# EAGLE design de10_out_board (EAGLE 9.0.1)
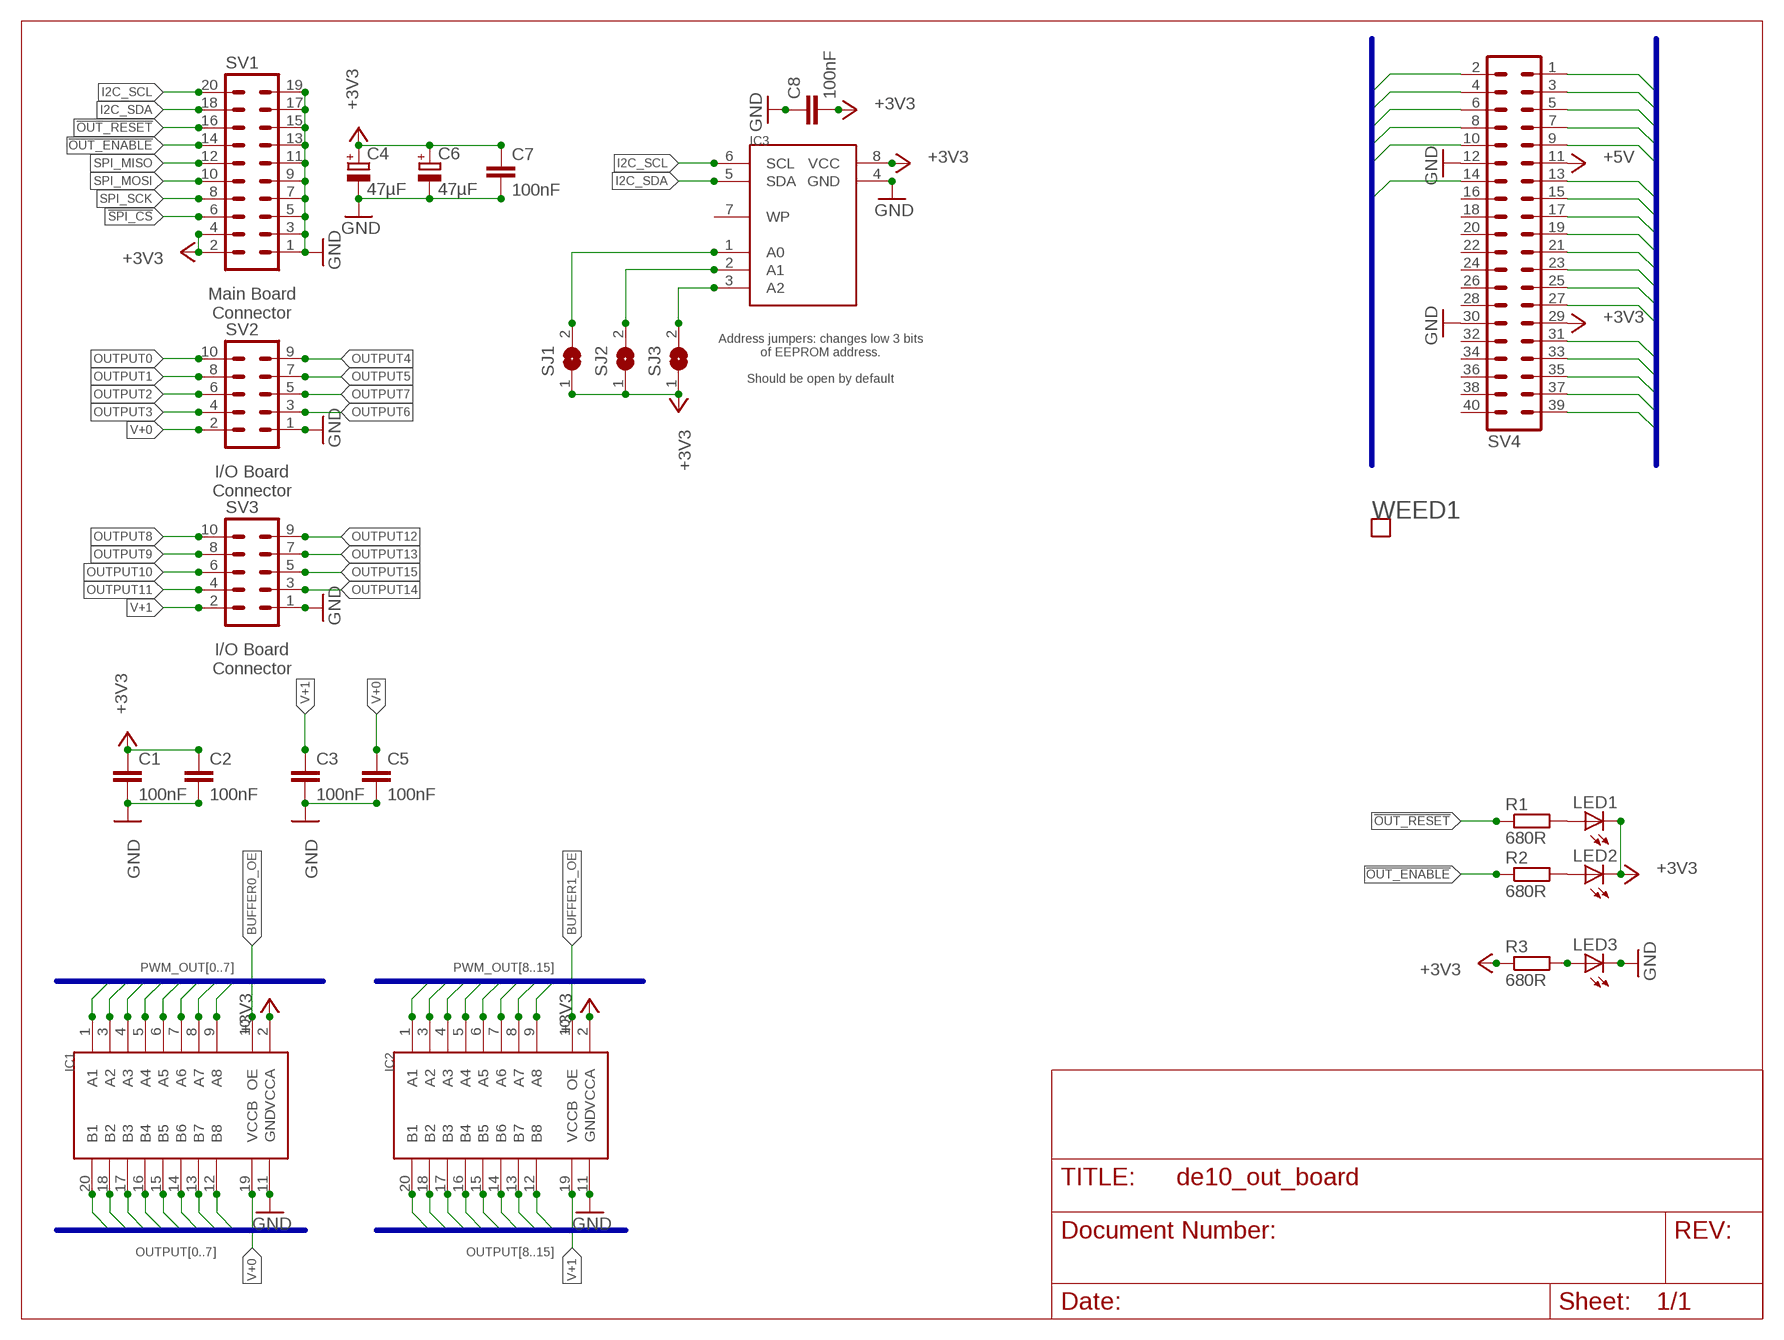
[diagram p0: schematic, sheet 1]

## Parts
C1  100nF  C-EUC0805  [C0805]
C2  100nF  C-EUC0805  [C0805]
C3  100nF  C-EUC0805  [C0805]
C4  47µF  CPOL-EUCT7343  [CT7343]
C5  100nF  C-EUC0805  [C0805]
C6  47µF  CPOL-EUCT7343  [CT7343]
C7  100nF  C-EUC0805  [C0805]
C8  100nF  C-EUC0805  [C0805]
IC1  TXB0108TSSOP20  [TSSOP20]
IC2  TXB0108TSSOP20  [TSSOP20]
IC3  AT24C02DSOIC-8  [SOIC8]
LED1  LEDCHIPLED_1206  [CHIPLED_1206]
LED2  LEDCHIPLED_1206  [CHIPLED_1206]
LED3  LEDCHIPLED_1206  [CHIPLED_1206]
R1  680R  R-EU_M0805  [M0805]
R2  680R  R-EU_M0805  [M0805]
R3  680R  R-EU_M0805  [M0805]
SJ1  SJ  [SJ]
SJ2  SJ  [SJ]
SJ3  SJ  [SJ]
SV1  MA10-2  [MA10-2]
SV2  MA05-2  [MA05-2]
SV3  MA05-2  [MA05-2]
SV4  MA20-2  [MA20-2]
WEED1  WEED  [DOINK]

## Nets
!OUT_ENABLE: R2.1 SV1.14 SV4.10
!OUT_RESET: R1.1 SV1.16 SV4.14
!SPI_CS: SV1.6 SV4.2
+3V3: C1.1 C2.1 C4.+ C6.+ C7.1 C8.2 IC1.2(VCCA) IC2.2(VCCA) IC3.8(VCC) LED1.C LED2.C R3.1 SJ1.1 SJ2.1 SJ3.1 SV1.2 SV1.4 SV4.29
+5V: SV4.11
BUFFER0_OE: IC1.10(OE) SV4.21
BUFFER1_OE: IC2.10(OE) SV4.1
GND: C1.2 C2.2 C3.2 C4.- C5.2 C6.- C7.2 C8.1 IC1.11(GND) IC2.11(GND) IC3.4(GND) LED3.C SV1.1 SV1.3 SV1.5 SV1.7 SV1.9 SV1.11 SV1.13 SV1.15 SV1.17 SV1.19 SV2.1 SV3.1 SV4.12 SV4.30
I2C_SCL: IC3.6(SCL) SV1.20
I2C_SDA: IC3.5(SDA) SV1.18
N$1: LED2.A R2.2
N$2: LED1.A R1.2
N$3: LED3.A R3.2
N$5: IC3.3(A2) SJ3.2
N$6: IC3.2(A1) SJ2.2
N$7: IC3.1(A0) SJ1.2
OUTPUT0: IC1.20(B1) SV2.10
OUTPUT1: IC1.18(B2) SV2.8
OUTPUT2: IC1.17(B3) SV2.6
OUTPUT3: IC1.16(B4) SV2.4
OUTPUT4: IC1.15(B5) SV2.9
OUTPUT5: IC1.14(B6) SV2.7
OUTPUT6: IC1.13(B7) SV2.3
OUTPUT7: IC1.12(B8) SV2.5
OUTPUT8: IC2.20(B1) SV3.10
OUTPUT9: IC2.18(B2) SV3.8
OUTPUT10: IC2.17(B3) SV3.6
OUTPUT11: IC2.16(B4) SV3.4
OUTPUT12: IC2.15(B5) SV3.9
OUTPUT13: IC2.14(B6) SV3.7
OUTPUT14: IC2.13(B7) SV3.3
OUTPUT15: IC2.12(B8) SV3.5
PWM_OUT0: IC1.9(A8) SV4.23
PWM_OUT1: IC1.8(A7) SV4.25
PWM_OUT2: IC1.7(A6) SV4.27
PWM_OUT3: IC1.6(A5) SV4.31
PWM_OUT4: IC1.5(A4) SV4.33
PWM_OUT5: IC1.4(A3) SV4.35
PWM_OUT6: IC1.3(A2) SV4.37
PWM_OUT7: IC1.1(A1) SV4.39
PWM_OUT8: IC2.9(A8) SV4.3
PWM_OUT9: IC2.8(A7) SV4.5
PWM_OUT10: IC2.7(A6) SV4.7
PWM_OUT11: IC2.6(A5) SV4.9
PWM_OUT12: IC2.5(A4) SV4.13
PWM_OUT13: IC2.4(A3) SV4.15
PWM_OUT14: IC2.3(A2) SV4.17
PWM_OUT15: IC2.1(A1) SV4.19
SPI_MISO: SV1.12 SV4.8
SPI_MOSI: SV1.10 SV4.6
SPI_SCK: SV1.8 SV4.4
V+0: C5.1 IC1.19(VCCB) SV2.2
V+1: C3.1 IC2.19(VCCB) SV3.2
Unconnected: IC3.7(WP) SV4.16 SV4.18 SV4.20 SV4.22 SV4.24 SV4.26 SV4.28 SV4.32 SV4.34 SV4.36 SV4.38 SV4.40

## Buses
PWM_OUT[0..7]
OUTPUT[0..7]
OUTPUT[8..15]
PWM_OUT[8..15]
!OUT_ENABLE,!OUT_RESET,!SPI_CS,BUFFER0_OE,BUFFER1_OE,PWM_OUT[0..15],SPI_MISO,SPI_MOSI,SPI_SCK

## Notes on the sheet
- Main Board
  Connector
- Address jumpers: changes low 3 bits
  of EEPROM address.
  
  Should be open by default
- I/O Board
  Connector
- I/O Board
  Connector

## Library data of the parts
C1-C3 C5 C7 C8 = rcl:C-EU: CAPACITOR, European symbol; MOUSER: 710-885012207072; SPICEPREFIX: C
C4 C6 = rcl:CPOL-EU: POLARIZED CAPACITOR, European symbol; MOUSER: 581-TAJD476M016RNJV; SPICEPREFIX: C
IC1 IC2 = lichtenstein_onion:TXB0108: 8-Bit Bidirectional Voltage-Level Translator with Auto-Direction Sensing and ±15-kV ESD Protection Datasheet <http://www.ti.com/lit/ds/symlink/txb0108.pdf>; MOUSER: 595-TXB0108PWR
IC3 = lichtenstein_onion:AT24C02D: I2C-Compatible (2-wire) Serial EEPROM; 1-Kbit (128 x 8) or 2-Kbit (256 x 8) Datasheet <http://ww1.microchip.com/downloads/en/DeviceDoc/Atmel-8871F-SEEPROM-AT24C01D-02D-Datasheet.pdf>; MOUSER: 556-AT24C02D-SSHM-T
LED1-LED3 = led:LED: LED OSRAM: - CHIPLED LG R971, LG N971, LY N971, LG Q971, LY Q971, LO R971, LY R971 LH N974, LH R974 LS Q976, LO Q976, LY Q976 LO Q996 - Hyper CHIPLED LW Q18S LB Q993, LB Q99A, LB R99A - SideLED LS A670, LO A670, LY A670, LG A670, LP A670 LB A673, LV A673, LT A673, LW A673 LH A674 LY A675 LS A676, LA A676, LO A676, LY A676, LW A676 LS A679, LY A679, LG A679 - Hyper Micro SIDELED® LS Y876, LA Y876, LO Y876, LY Y876 LT Y87S - SmartLED LW L88C, LW L88S LB L89C, LB L89S, LG L890 LS L89K, LO L89K, LY L89K LS L896, LA L896, LO L896, LY L896 - TOPLED LS T670, LO T670, LY T670, LG T670, LP T670 LSG T670, LSP T670, LSY T670, LOP T670, LYG T670 LG T671, LOG T671, LSG T671 LB T673, LV T673, LT T673, LW T673 LH T674 LS T676, LA T676, LO T676, LY T676, LB T676, LH T676, LSB T676, LW T676 LB T67C, LV T67C, LT T67C, LS T67K, LO T67K, LY T67K, LW E67C LS E67B, LA E67B, LO E67B, LY E67B, LB E67C, LV E67C, LT E67C LW T67C LS T679, LY T679, LG T679 LS T770, LO T770, LY T770, LG T770, LP T770 LB T773, LV T773, LT T773, LW T773 LH T774 LS E675, LA E675, LY E675, LS T675 LS T776, LA T776, LO T776, LY T776, LB T776 LHGB T686 LT T68C, LB T68C - Hyper Mini TOPLED® LB M676 - Mini TOPLED Santana® LG M470 LS M47K, LO M47K, LY M47K Source: http://www.osram.convergy.de LUXEON: - LUMILED® LXK2-PW12-R00, LXK2-PW12-S00, LXK2-PW14-U00, LXK2-PW14-V00 LXK2-PM12-R00, LXK2-PM12-S00, LXK2-PM14-U00 LXK2-PE12-Q00, LXK2-PE12-R00, LXK2-PE12-S00, LXK2-PE14-T00, LXK2-PE14-U00 LXK2-PB12-K00, LXK2-PB12-L00, LXK2-PB12-M00, LXK2-PB14-N00, LXK2-PB14-P00, LXK2-PB14-Q00 LXK2-PR12-L00, LXK2-PR12-M00, LXK2-PR14-Q00, LXK2-PR14-R00 LXK2-PD12-Q00, LXK2-PD12-R00, LXK2-PD12-S00 LXK2-PH12-R00, LXK2-PH12-S00 LXK2-PL12-P00, LXK2-PL12-Q00, LXK2-PL12-R00 Source: www.luxeon.com KINGBRIGHT: KA-3528ASYC Source: www.kingbright.com; MOUSER: 604-APTR3216SGC
R1-R3 = rcl:R-EU_: RESISTOR, European symbol; MOUSER: 652-CR0805-FX6800GLF; SPICEPREFIX: R
SJ1-SJ3 = jumper:SJ: SMD solder JUMPER
SV1 = con-lstb:MA10-2: PIN HEADER; MOUSER: 517-30320-6002; OC_FARNELL: unknown; OC_NEWARK: unknown
SV2 SV3 = con-lstb:MA05-2: PIN HEADER; MOUSER: 517-30310-6002; OC_FARNELL: unknown; OC_NEWARK: unknown
SV4 = con-lstb:MA20-2: PIN HEADER; OC_FARNELL: unknown; OC_NEWARK: unknown; SPICEPREFIX: X
WEED1 = lichtenstein_onion:WEED

## Board
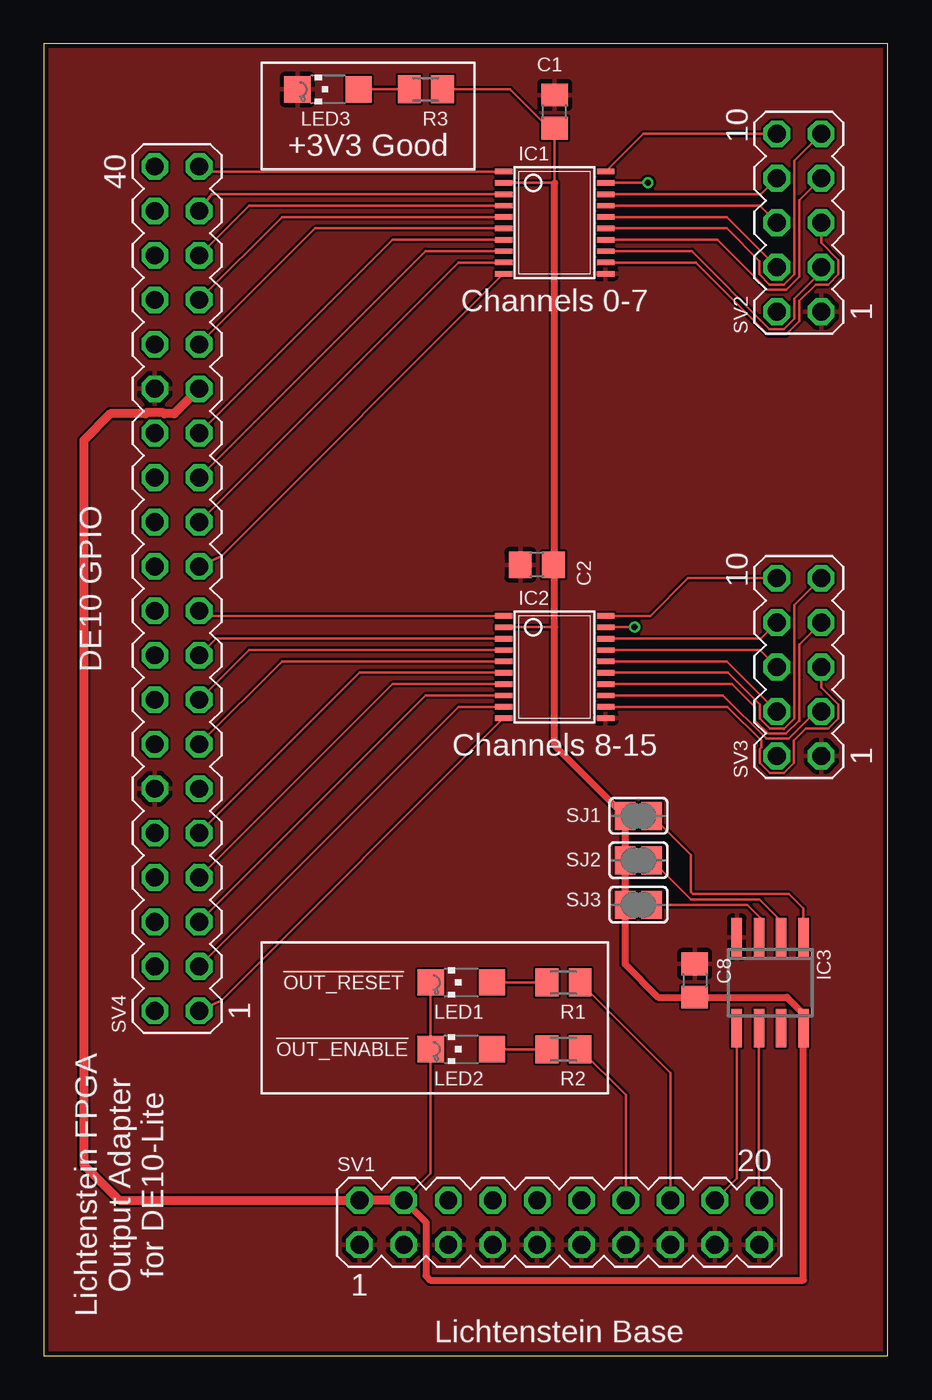
[diagram p1: board, top side]
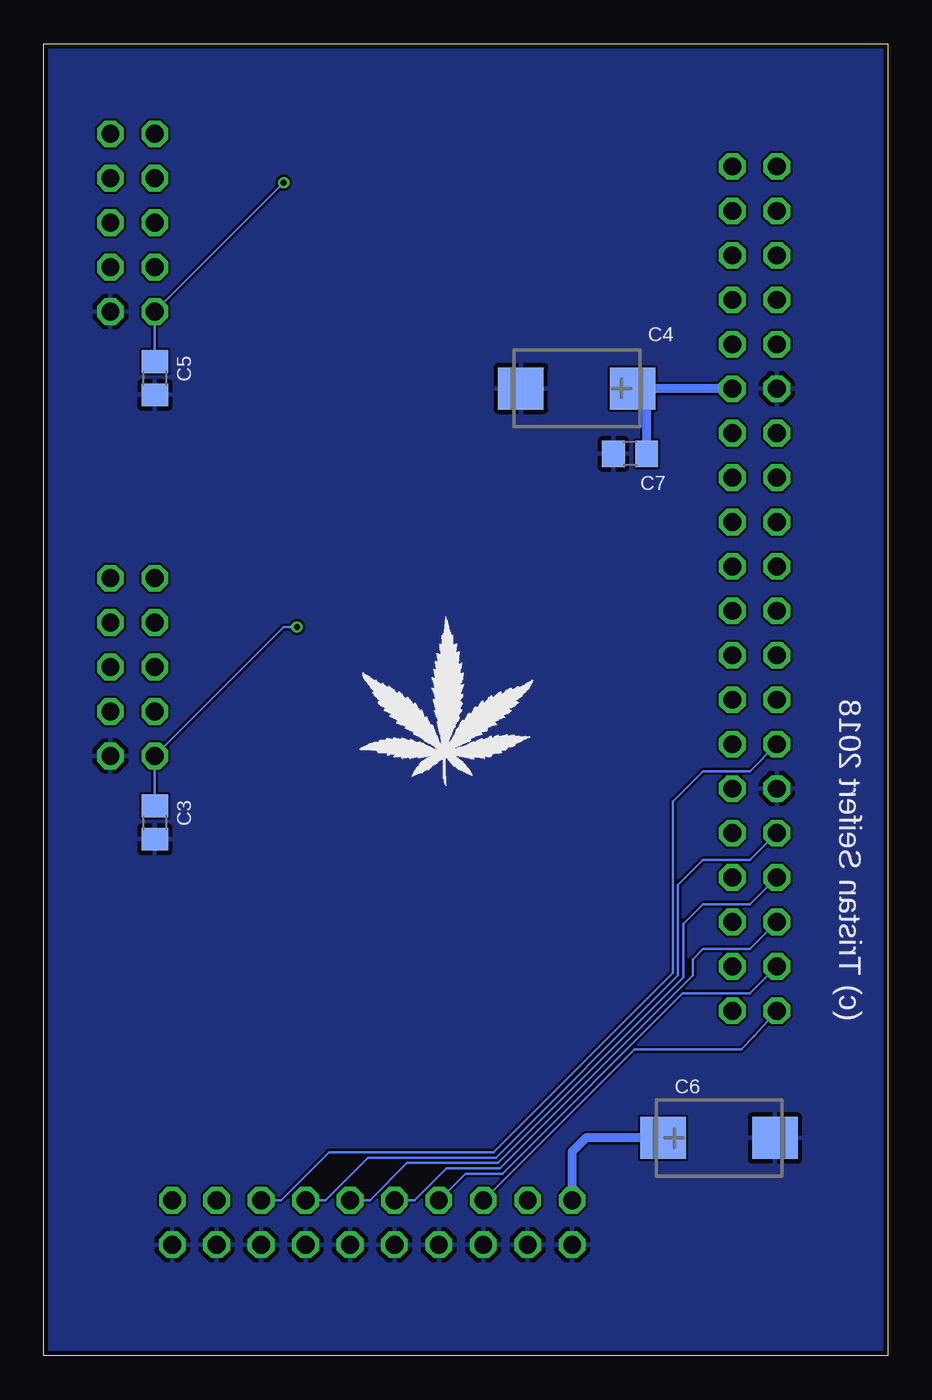
[diagram p2: board, bottom side, seen from below]

Size 48.26 x 75 mm. Coordinates in mm from the lower left corner, seen from the top.
Outline: 0,0 48.26,0 48.26,75 0,75 0,0
Copper layers (1*16): Top 0.035mm / dielectric 1.5mm / Bottom 0.035mm
Design rules "dirtypcbs_2_layer": minimum track width 5mil, minimum drill 12mil, track to track 5mil, track to pad 5mil, pad to pad 5mil, via to via 5mil, smd to smd 0mil, copper to edge 10mil, drill to drill 10mil, minimum pad ring 10mil, minimum via ring 6mil, stop-mask expansion 2mil, vias tented up to drill 25mil, thermal gap 10mil

### Footprints (pad centres in the part's own frame; a part is rotated, then mirrored left to right if it is on the bottom)
C0805 = smd 1.3 x 1.5: 1 -0.95,0; 2 0.95,0
CT7343 = smd 2.6 x 2.4: + -3.2,0; - 3.2,0
TSSOP20 = smd 0.305 x 0.991: 1 -2.925,-2.918; 2 -2.275,-2.918; 3 -1.625,-2.918; 4 -0.975,-2.918; 5 -0.325,-2.918; 6 0.325,-2.918; 7 0.975,-2.918; 8 1.625,-2.918; 9 2.275,-2.918; 10 2.925,-2.918; 11 2.925,2.918; 12 2.275,2.918; 13 1.625,2.918; 14 0.975,2.918; 15 0.325,2.918; 16 -0.325,2.918; 17 -0.975,2.918; 18 -1.625,2.918; 19 -2.275,2.918; 20 -2.925,2.918
SOIC8 = smd 0.6 x 2.2: 1 -1.905,-2.6; 2 -0.635,-2.6; 3 0.635,-2.6; 4 1.905,-2.6; 5 1.905,2.6; 6 0.635,2.6; 7 -0.635,2.6; 8 -1.905,2.6
CHIPLED_1206 = smd 1.5 x 1.5: A 0,-1.75; C 0,1.75
M0805 = smd 1.3 x 1.6: 1 -0.95,0; 2 0.95,0
SJ = smd 1.168 x 1.6: 1 -0.762,0; 2 0.762,0
MA10-2 = drill 1.016 octagon: 1 -11.43,-1.27; 2 -11.43,1.27; 3 -8.89,-1.27; 4 -8.89,1.27; 5 -6.35,-1.27; 6 -6.35,1.27; 7 -3.81,-1.27; 8 -3.81,1.27; 9 -1.27,-1.27; 10 -1.27,1.27; 11 1.27,-1.27; 12 1.27,1.27; 13 3.81,-1.27; 14 3.81,1.27; 15 6.35,-1.27; 16 6.35,1.27; 17 8.89,-1.27; 18 8.89,1.27; 19 11.43,-1.27; 20 11.43,1.27
MA05-2 = drill 1.016 octagon: 1 -5.08,-1.27; 2 -5.08,1.27; 3 -2.54,-1.27; 4 -2.54,1.27; 5 0,-1.27; 6 0,1.27; 7 2.54,-1.27; 8 2.54,1.27; 9 5.08,-1.27; 10 5.08,1.27
MA20-2 = drill 1.016 octagon: 1 -24.13,-1.27; 2 -24.13,1.27; 3 -21.59,-1.27; 4 -21.59,1.27; 5 -19.05,-1.27; 6 -19.05,1.27; 7 -16.51,-1.27; 8 -16.51,1.27; 9 -13.97,-1.27; 10 -13.97,1.27; 11 -11.43,-1.27; 12 -11.43,1.27; 13 -8.89,-1.27; 14 -8.89,1.27; 15 -6.35,-1.27; 16 -6.35,1.27; 17 -3.81,-1.27; 18 -3.81,1.27; 19 -1.27,-1.27; 20 -1.27,1.27; 21 1.27,-1.27; 22 1.27,1.27; 23 3.81,-1.27; 24 3.81,1.27; 25 6.35,-1.27; 26 6.35,1.27; 27 8.89,-1.27; 28 8.89,1.27; 29 11.43,-1.27; 30 11.43,1.27; 31 13.97,-1.27; 32 13.97,1.27; 33 16.51,-1.27; 34 16.51,1.27; 35 19.05,-1.27; 36 19.05,1.27; 37 21.59,-1.27; 38 21.59,1.27; 39 24.13,-1.27; 40 24.13,1.27

### Placement (x,y rotation side)
C1  29.21,71.12 90 top
C2  28.19,45.21 180 top
C3  41.91,30.48 270 bottom
C4  17.78,55.3 180 bottom
C5  41.91,55.88 270 bottom
C6  9.65,12.45 0 bottom
C7  14.73,51.56 180 bottom
C8  37.22,21.45 270 top
IC1  29.21,64.77 270 top
IC2  29.21,39.37 270 top
IC3  41.53,21.32 180 top
LED1  23.88,21.34 90 top
LED2  23.88,17.53 90 top
LED3  16.26,72.39 90 top
R1  29.72,21.34 180 top
R2  29.72,17.53 180 top
R3  21.84,72.39 180 top
SJ1  34,30.86 0 top
SJ2  34,28.32 0 top
SJ3  34,25.78 0 top
SV1  29.48,7.62 0 top
SV2  43.18,64.77 90 top
SV3  43.18,39.37 90 top
SV4  7.62,43.85 90 top
WEED1  30.23,32.51 0 bottom

### Tracks (layer width: path | path; a pad name or v marks a point on that pad's centre or on a via)
!OUT_ENABLE
  Top 0.152: R2.1 33.29,14.9 SV1.14
  Bottom 0.152: SV4.10 7.9,28.33 10.57,28.33 11.99,26.91 11.99,21.75 22.42,11.33 29.71,11.33 32.15,8.89 SV1.14
!OUT_RESET
  Top 0.152: R1.1 35.83,16.17 SV1.16
  Bottom 0.152: SV4.14 7.9,33.41 10.57,33.41 12.29,31.69 12.29,21.88 22.54,11.63 31.95,11.63 34.69,8.89 SV1.16
!SPI_CS
  Bottom 0.152: SV1.6 14.49,17.53 8.38,17.53 7.62,18.29 SV4.2
+3V3
  Top 0.152: IC1.2 26.3,67.06 29.21,67.06 29.21,69.6 | IC2.2 26.3,41.66 29.21,41.66 | 29.21,69.85 29.21,69.6 | C2.1 29.21,45.15 29.21,44.45 | 28.89,69.6 29.21,69.6 | R3.1 26.67,72.39 29.21,69.85 | LED1.C LED2.C 22.13,10.43 SV1.4 | C1.1 29.21,69.85
  Top 0.406: 29.21,67.06 29.21,44.45 29.21,41.66 29.21,34.89 SJ1.1 SJ2.1 SJ3.1 33.24,22.39 35.13,20.5 C8.2 42.49,20.5 43.44,19.56 IC3.8 43.44,4.32 43.43,4.32 22.1,4.32 21.84,4.57 21.84,7.64 SV1.4
  Top 0.508: SV1.4 SV1.2 4.32,8.89 2.29,10.92 2.29,52.32 3.81,53.85 5.81,53.85 5.87,53.91 6.83,53.91 6.89,53.85 7.46,53.85 SV4.29
  Bottom 0.508: SV4.29 13.97,55.28 | 13.97,55.28 14.56,55.28 C4.+ | C7.1 13.78,55.09 13.97,55.28 | C6.+ 17.27,12.45 18.05,11.67 SV1.2
BUFFER0_OE
  Top 0.152: IC1.10 10.16,45.71 SV4.21
BUFFER1_OE
  Top 0.152: IC2.10 10.16,20.31 SV4.1
GND
  pour Top: 0,0 0,75 48.26,75 48.26,0
  pour Bottom: 0,0 0,75 48.26,75 48.26,0
I2C_SCL
  Top 0.152: IC3.6 40.9,8.9 SV1.20
I2C_SDA
  Top 0.152: IC3.5 39.62,10.14 SV1.18
N$1
  Top 0.152: LED2.A R2.2
N$2
  Top 0.152: LED1.A R1.2
N$3
  Top 0.152: R3.2 LED3.A
N$5
  Top 0.152: SJ3.2 40.22,25.78 41,25 40.9,24.89 IC3.3
N$6
  Top 0.152: SJ2.2 37,26.09 40.91,26.09 42.16,24.84 IC3.2
N$7
  Top 0.152: SJ1.2 37,28.62 37,26.51 37.12,26.39 42.61,26.39 43.44,25.57 IC3.1
OUTPUT0
  Top 0.152: IC1.20 34.28,69.85 SV2.10
OUTPUT1
  Top 0.152: SV2.8 40.99,66.39 IC1.18
OUTPUT2
  Top 0.152: IC1.17 40.94,65.75 SV2.6
OUTPUT3
  Top 0.152: IC1.16 39.05,65.09 SV2.4
OUTPUT4
  Top 0.152: IC1.15 39.05,64.44 40.92,62.57 40.92,61.82 41.5,61.24 42.32,61.24 42.9,61.82 42.9,68.3 SV2.9
OUTPUT5
  Top 0.152: SV2.7 43.2,66.06 43.2,61.69 42.45,60.94 41.37,60.94 38.51,63.8 IC1.14
OUTPUT6
  Top 0.152: IC1.13 37.05,63.15 41.5,58.7 42.32,58.7 42.9,59.28 42.9,60.43 44.45,61.98 SV2.3
OUTPUT7
  Top 0.152: IC1.12 37.27,62.49 41.37,58.4 42.45,58.4 43.2,59.15 43.2,60.3 44.14,61.24 44.86,61.24 45.44,61.82 45.44,62.64 44.45,63.63 SV2.5
OUTPUT8
  Top 0.152: IC2.20 34.67,42.3 36.83,44.45 SV3.10
OUTPUT9
  Top 0.152: SV3.8 40.99,40.99 IC2.18
OUTPUT10
  Top 0.152: SV3.6 40.94,40.34 IC2.17
OUTPUT11
  Top 0.152: SV3.4 39.05,39.7 IC2.16
OUTPUT12
  Top 0.152: SV3.9 42.9,42.9 42.9,36.42 42.32,35.84 42.3,35.87 41.51,35.87 40.95,36.43 40.95,37.22 39.12,39.05 IC2.15
OUTPUT13
  Top 0.152: SV3.7 43.2,40.66 43.2,36.29 43.17,36.29 42.44,35.56 41.42,35.56 40.66,36.31 40.66,37.08 39.35,38.4 IC2.14
OUTPUT14
  Top 0.152: SV3.3 44.45,36.58 43.88,36.58 42.59,35.28 41.3,35.28 38.84,37.74 IC2.13
OUTPUT15
  Top 0.152: SV3.5 44.45,38.2 45.41,37.23 45.41,36.43 44.85,35.87 43.57,35.87 42.88,35.17 42.88,33.89 42.31,33.33 41.51,33.33 40.95,33.89 40.95,34.69 41.02,34.76 41.02,35.17 39.09,37.09 IC2.12
PWM_OUT0
  Top 0.152: SV4.23 23.73,62.49 IC1.9
PWM_OUT1
  Top 0.152: SV4.25 21.84,63.15 IC1.8
PWM_OUT2
  Top 0.152: IC1.7 19.95,63.8 SV4.27
PWM_OUT3
  Top 0.152: IC1.6 15.52,64.44 SV4.31
PWM_OUT4
  Top 0.152: IC1.5 13.62,65.09 SV4.33
PWM_OUT5
  Top 0.152: IC1.4 11.73,65.75 SV4.35
PWM_OUT6
  Top 0.152: IC1.3 9.59,66.39 SV4.37
PWM_OUT7
  Top 0.152: IC1.1 9.18,67.69 SV4.39
PWM_OUT8
  Top 0.152: IC2.9 23.73,37.09 SV4.3
PWM_OUT9
  Top 0.152: IC2.8 21.84,37.74 SV4.5
PWM_OUT10
  Top 0.152: IC2.7 19.95,38.4 SV4.7
PWM_OUT11
  Top 0.152: IC2.6 18.05,39.05 SV4.9
PWM_OUT12
  Top 0.152: IC2.5 13.62,39.7 SV4.13
PWM_OUT13
  Top 0.152: IC2.4 11.73,40.34 SV4.15
PWM_OUT14
  Top 0.152: IC2.3 9.85,40.99 SV4.17
PWM_OUT15
  Top 0.152: IC2.1 9.18,42.3 SV4.19
SPI_MISO
  Bottom 0.152: SV4.8 7.9,25.79 10.57,25.79 11.68,24.68 11.68,21.63 22.29,11.02 27.48,11.02 29.61,8.89 SV1.12
SPI_MOSI
  Bottom 0.152: SV4.6 7.9,23.25 10.57,23.25 11.15,22.67 11.15,21.73 22.16,10.72 25.24,10.72 27.07,8.89 SV1.10
SPI_SCK
  Bottom 0.152: SV4.4 7.9,20.71 11.74,20.71 22.04,10.41 24.15,10.41 SV1.8
V+0  (via drill 0.35)
  Top 0.152: v34.54,67.06 34.53,67.05 IC1.19
  Bottom 0.152: C5.1 SV2.2 v34.54,67.06
V+1  (via drill 0.35)
  Top 0.152: v33.78,41.66 33.77,41.65 IC2.19
  Bottom 0.152: C3.1 SV3.2 34.54,41.66 v33.78,41.66

### Text on the board
tNames: +3V3 Good | Channels 0-7 | DE10 GPIO | Channels 8-15 | !OUT_RESET | !OUT_ENABLE | Lichtenstein FPGA / Output Adapter / for DE10-Lite | Lichtenstein Base
bNames: (c) Tristan Seifert 2018